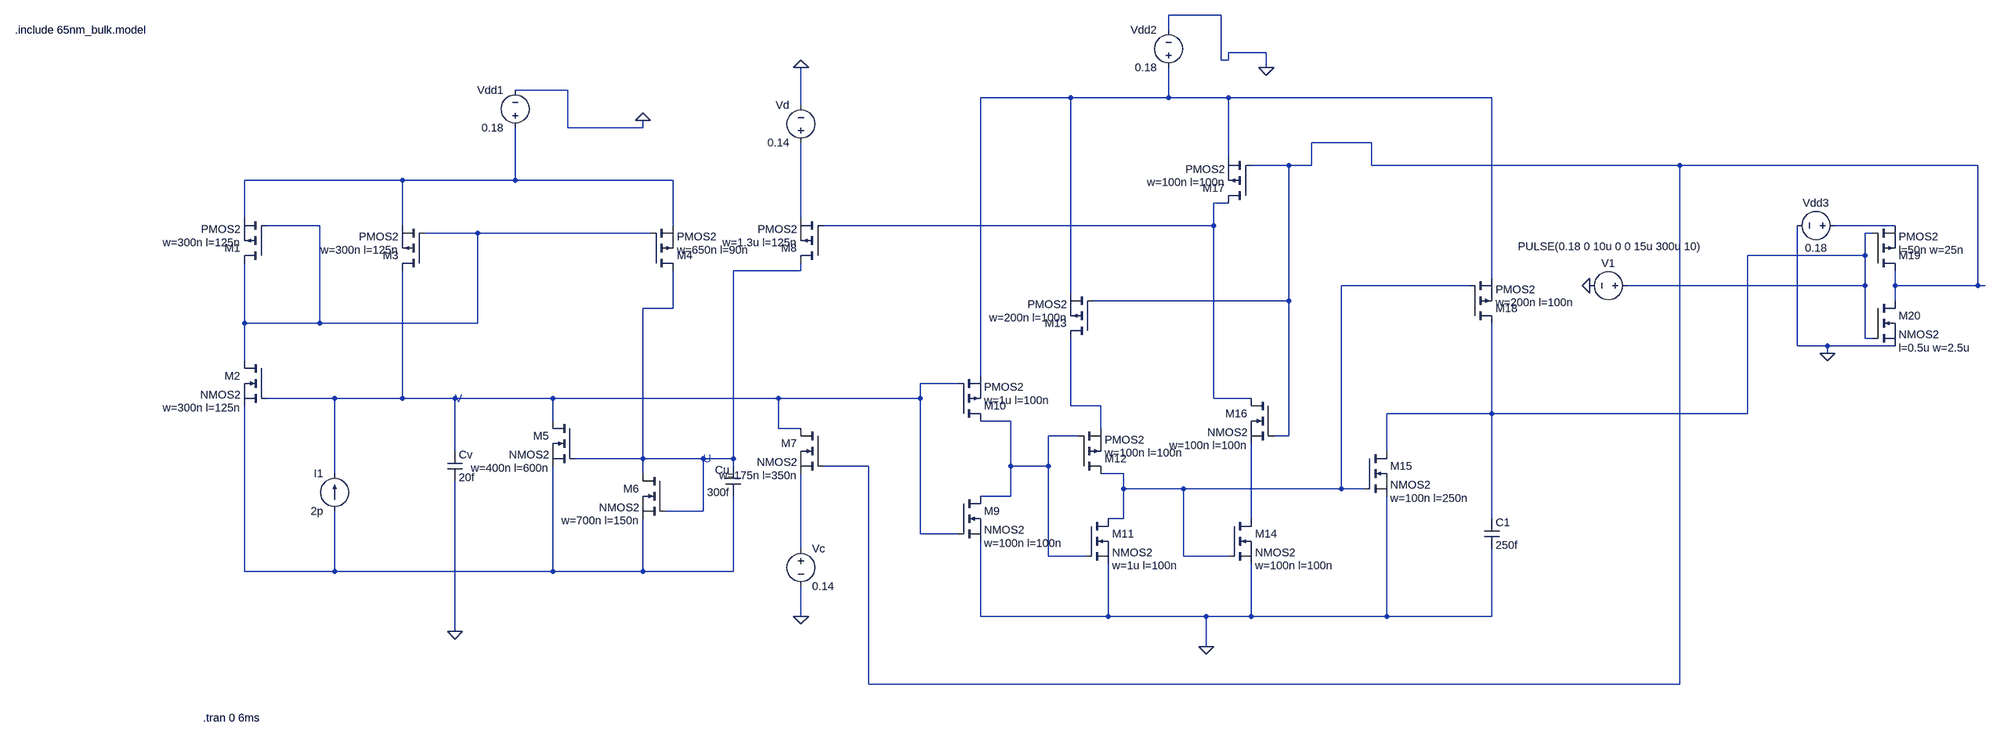
[diagram p0: schematic izhikevich_neurontemplatetest38.asc]
izhikevich_neurontemplatetest38.asc, the LTspice schematic file:
Version 4.1
SHEET 1 3168 1620
WIRE 1280 -240 1168 -240
WIRE 1168 -208 1168 -240
WIRE 1376 -160 1296 -160
WIRE 1280 -144 1280 -240
WIRE 1296 -144 1296 -160
WIRE 1296 -144 1280 -144
WIRE 1376 -128 1376 -160
WIRE -160 -80 -272 -80
WIRE 960 -64 768 -64
WIRE 1168 -64 1168 -128
WIRE 1168 -64 960 -64
WIRE 1296 -64 1168 -64
WIRE 1856 -64 1296 -64
WIRE 336 -48 336 -128
WIRE -160 0 -160 -80
WIRE 0 0 0 -16
WIRE 0 0 -160 0
WIRE 1600 32 1472 32
WIRE 1296 64 1296 -64
WIRE 1424 80 1344 80
WIRE 1472 80 1472 32
WIRE 1472 80 1424 80
WIRE 1600 80 1600 32
WIRE 2256 80 1600 80
WIRE 3088 80 2256 80
WIRE -512 112 -848 112
WIRE -272 112 -272 0
WIRE -272 112 -512 112
WIRE 64 112 -272 112
WIRE 1296 160 1264 160
WIRE -848 192 -848 112
WIRE 336 192 336 32
WIRE -688 208 -800 208
WIRE -512 208 -512 112
WIRE 64 208 64 112
WIRE 1264 208 1264 160
WIRE 1264 208 384 208
WIRE 2912 208 2784 208
WIRE -352 224 -464 224
WIRE 16 224 -352 224
WIRE 2864 224 2848 224
WIRE 2848 272 2848 224
WIRE 2848 272 2400 272
WIRE 336 304 336 288
WIRE 336 304 192 304
WIRE 1856 320 1856 -64
WIRE 1808 336 1536 336
WIRE 2848 336 2848 272
WIRE 2848 336 2144 336
WIRE 2912 336 2912 304
WIRE 3088 336 3088 80
WIRE 3088 336 2912 336
WIRE 3104 336 3088 336
WIRE 960 352 960 -64
WIRE 1424 368 1424 80
WIRE 1424 368 1008 368
WIRE 2912 368 2912 336
WIRE 64 384 64 304
WIRE 64 384 0 384
WIRE -848 416 -848 288
WIRE -688 416 -688 208
WIRE -688 416 -848 416
WIRE -352 416 -352 224
WIRE -352 416 -688 416
WIRE 2848 448 2848 336
WIRE 2864 448 2848 448
WIRE 2704 464 2704 208
WIRE 2768 464 2704 464
WIRE 2912 464 2768 464
WIRE 2768 480 2768 464
WIRE -848 496 -848 416
WIRE 768 528 768 -64
WIRE 720 544 640 544
WIRE -656 576 -800 576
WIRE -512 576 -512 304
WIRE -512 576 -656 576
WIRE -400 576 -512 576
WIRE -192 576 -400 576
WIRE 288 576 -192 576
WIRE 640 576 640 544
WIRE 640 576 288 576
WIRE 1264 576 1264 208
WIRE 1344 576 1264 576
WIRE 960 592 960 448
WIRE 1024 592 960 592
WIRE 1856 608 1856 416
WIRE 1856 608 1632 608
WIRE 2400 608 2400 272
WIRE 2400 608 1856 608
WIRE -192 624 -192 576
WIRE 832 624 768 624
WIRE 288 640 288 576
WIRE 336 640 288 640
WIRE 1024 640 1024 592
WIRE 976 656 912 656
WIRE 1424 656 1424 368
WIRE 1424 656 1392 656
WIRE -400 688 -400 576
WIRE 1632 688 1632 608
WIRE 0 704 0 384
WIRE 0 704 -144 704
WIRE 128 704 0 704
WIRE 192 704 192 304
WIRE 192 704 128 704
WIRE 192 720 192 704
WIRE 480 720 384 720
WIRE 832 720 832 624
WIRE 912 720 912 656
WIRE 912 720 832 720
WIRE -656 736 -656 576
WIRE 0 736 0 704
WIRE 1072 736 1024 736
WIRE 1072 768 1072 736
WIRE 1200 768 1072 768
WIRE 1536 768 1536 336
WIRE 1536 768 1200 768
WIRE 1584 768 1536 768
WIRE 832 784 832 720
WIRE 832 784 768 784
WIRE 128 816 128 704
WIRE 128 816 48 816
WIRE 1072 832 1072 768
WIRE 1072 832 1040 832
WIRE 1344 832 1344 672
WIRE 1856 832 1856 608
WIRE 640 864 640 576
WIRE 720 864 640 864
WIRE 336 896 336 736
WIRE 912 912 912 720
WIRE 992 912 912 912
WIRE 1200 912 1200 768
WIRE 1296 912 1200 912
WIRE -848 944 -848 592
WIRE -656 944 -656 816
WIRE -656 944 -848 944
WIRE -192 944 -192 720
WIRE -192 944 -656 944
WIRE 0 944 0 832
WIRE 0 944 -192 944
WIRE 192 944 192 784
WIRE 192 944 0 944
WIRE 336 1040 336 976
WIRE 768 1040 768 880
WIRE 1040 1040 1040 928
WIRE 1040 1040 768 1040
WIRE 1248 1040 1040 1040
WIRE 1344 1040 1344 928
WIRE 1344 1040 1248 1040
WIRE 1632 1040 1632 784
WIRE 1632 1040 1344 1040
WIRE 1856 1040 1856 896
WIRE 1856 1040 1632 1040
WIRE -400 1072 -400 752
WIRE 1248 1104 1248 1040
WIRE 480 1184 480 720
WIRE 2256 1184 2256 80
WIRE 2256 1184 480 1184
FLAG 0 -16 0
FLAG 336 -128 0
FLAG 1376 -128 0
FLAG 336 1040 0
FLAG -400 1072 0
FLAG 1248 1104 0
FLAG 2768 480 0
FLAG 2064 336 0
DATAFLAG 3072 336 ""
DATAFLAG 2832 336 ""
DATAFLAG 2304 336 ""
DATAFLAG 2064 80 ""
SYMBOL voltage 336 880 R0
WINDOW 123 0 0 Left 0
WINDOW 39 0 0 Left 0
SYMATTR InstName Vc
SYMATTR Value 0.14
SYMBOL current -656 816 R180
WINDOW 0 24 80 Left 2
WINDOW 3 24 0 Left 2
WINDOW 123 0 0 Left 0
WINDOW 39 0 0 Left 0
SYMATTR InstName I1
SYMATTR Value 2p
SYMBOL voltage -272 16 R180
WINDOW 0 24 96 Left 2
WINDOW 3 24 16 Left 2
WINDOW 123 0 0 Left 0
WINDOW 39 0 0 Left 0
SYMATTR InstName Vdd1
SYMATTR Value 0.18
SYMBOL voltage 1168 -112 R180
WINDOW 0 24 96 Left 2
WINDOW 3 24 16 Left 2
WINDOW 123 0 0 Left 0
WINDOW 39 0 0 Left 0
SYMATTR InstName Vdd2
SYMATTR Value 0.18
SYMBOL voltage 336 48 R180
WINDOW 0 24 96 Left 2
WINDOW 3 24 16 Left 2
WINDOW 123 0 0 Left 0
WINDOW 39 0 0 Left 0
SYMATTR InstName Vd
SYMATTR Value 0.14
SYMBOL cap 208 720 M0
SYMATTR InstName Cu
SYMATTR Value 300f
SYMBOL cap -416 688 R0
SYMATTR InstName Cv
SYMATTR Value 20f
SYMBOL cap 1840 832 R0
SYMATTR InstName C1
SYMATTR Value 250f
SYMBOL pmos -800 288 R180
WINDOW 123 56 44 Left 2
WINDOW 39 56 16 Left 2
SYMATTR Value2 w=300n l=125n
SYMATTR InstName M1
SYMATTR Value PMOS2
SYMBOL pmos -464 304 R180
WINDOW 123 56 44 Left 2
SYMATTR Value2 w=300n l=125n
SYMATTR InstName M3
SYMATTR Value PMOS2
SYMBOL pmos 16 304 M180
WINDOW 123 56 44 Left 2
WINDOW 39 56 16 Left 2
SYMATTR Value2 w=650n l=90n
SYMATTR InstName M4
SYMATTR Value PMOS2
SYMBOL pmos 384 288 R180
WINDOW 123 56 44 Left 2
SYMATTR Value2 w=1.3u l=125n
SYMATTR InstName M8
SYMATTR Value PMOS2
SYMBOL pmos 720 624 M180
WINDOW 123 56 44 Left 2
SYMATTR Value2 w=1u l=100n
SYMATTR InstName M10
SYMATTR Value PMOS2
SYMBOL pmos 1008 448 R180
WINDOW 123 56 44 Left 2
SYMATTR Value2 w=200n l=100n
SYMATTR InstName M13
SYMATTR Value PMOS2
SYMBOL pmos 1344 160 R180
WINDOW 123 56 44 Left 2
SYMATTR Value2 w=100n l=100n
SYMATTR InstName M17
SYMATTR Value PMOS2
SYMBOL pmos 1808 416 M180
WINDOW 123 56 44 Left 2
SYMATTR Value2 w=200n l=100n
SYMATTR InstName M18
SYMATTR Value PMOS2
SYMBOL nmos -800 496 M0
WINDOW 123 56 100 Left 2
WINDOW 39 56 128 Left 2
SYMATTR Value2 w=300n l=125n
SYMATTR InstName M2
SYMATTR Value NMOS2
SYMBOL nmos -144 624 M0
WINDOW 123 56 100 Left 2
WINDOW 39 56 128 Left 2
SYMATTR Value2 w=400n l=600n
SYMATTR InstName M5
SYMATTR Value NMOS2
SYMBOL nmos 48 736 M0
WINDOW 123 56 100 Left 2
WINDOW 39 56 128 Left 2
SYMATTR Value2 w=700n l=150n
SYMATTR InstName M6
SYMATTR Value NMOS2
SYMBOL nmos 384 640 M0
WINDOW 123 56 100 Left 2
SYMATTR Value2 w=175n l=350n
SYMATTR InstName M7
SYMATTR Value NMOS2
SYMBOL nmos 720 784 R0
WINDOW 123 56 100 Left 2
SYMATTR Value2 w=100n l=100n
SYMATTR InstName M9
SYMATTR Value NMOS2
SYMBOL nmos 992 832 R0
WINDOW 123 56 100 Left 2
SYMATTR Value2 w=1u l=100n
SYMATTR InstName M11
SYMATTR Value NMOS2
SYMBOL nmos 1296 832 R0
WINDOW 123 56 100 Left 2
SYMATTR Value2 w=100n l=100n
SYMATTR InstName M14
SYMATTR Value NMOS2
SYMBOL nmos 1584 688 R0
WINDOW 123 56 100 Left 2
SYMATTR Value2 w=100n l=250n
SYMATTR InstName M15
SYMATTR Value NMOS2
SYMBOL nmos 1392 576 M0
WINDOW 123 56 100 Left 2
SYMATTR Value2 w=100n l=100n
SYMATTR InstName M16
SYMATTR Value NMOS2
SYMBOL pmos 976 736 M180
WINDOW 123 56 44 Left 2
SYMATTR Value2 w=100n l=100n
SYMATTR InstName M12
SYMATTR Value PMOS2
SYMBOL pmos 2864 304 M180
WINDOW 123 56 44 Left 2
SYMATTR Value2 l=50n w=25n
SYMATTR InstName M19
SYMATTR Value PMOS2
SYMBOL nmos 2864 368 R0
WINDOW 123 56 100 Left 2
SYMATTR Value2 l=0.5u w=2.5u
SYMATTR InstName M20
SYMATTR Value NMOS2
SYMBOL voltage 2800 208 R90
WINDOW 0 -32 56 VBottom 2
WINDOW 3 32 56 VTop 2
WINDOW 123 0 0 Left 0
WINDOW 39 0 0 Left 0
SYMATTR InstName Vdd3
SYMATTR Value 0.18
SYMBOL voltage 2160 336 R90
WINDOW 0 -32 56 VBottom 2
WINDOW 3 -99 53 VTop 2
WINDOW 123 0 0 Left 0
WINDOW 39 0 0 Left 0
SYMATTR InstName V1
SYMATTR Value PULSE(0.18 0 10u 0 0 15u 300u 10)
TEXT 128 704 Left 2 ;U
TEXT -400 576 Left 2 ;V
TEXT -936 1256 Left 2 !.tran 0 6ms
TEXT -1336 -208 Left 2 !.include 65nm_bulk.model

The netlist it stands for:
* izhikevich_neurontemplatetest38.asc
Vc N015 0 0.14
I1 N016 N011 2p
Vdd1 N003 0 0.18
Vdd2 N001 0 0.18
Vd N005 0 0.14
Cu N009 N016 300f
Cv N011 0 20f
C1 N008 0 250f
M1 N006 N006 N003 N003 PMOS2 w=300n l=125n
M3 N011 N006 N003 N003 PMOS2 w=300n l=125n
M4 N009 N006 N003 N003 PMOS2 w=650n l=90n
M8 N009 N004 N005 N005 PMOS2 w=1.3u l=125n
M10 N013 N011 N001 N001 PMOS2 w=1u l=100n
M13 N012 N002 N001 N001 PMOS2 w=200n l=100n
M17 N004 N002 N001 N001 PMOS2 w=100n l=100n
M18 N008 N010 N001 N001 PMOS2 w=200n l=100n
M2 N006 N011 N016 N016 NMOS2 w=300n l=125n
M5 N011 N009 N016 N016 NMOS2 w=400n l=600n
M6 N009 N009 N016 N016 NMOS2 w=700n l=150n
M7 N011 N002 N015 N015 NMOS2 w=175n l=350n
M9 N013 N011 0 0 NMOS2 w=100n l=100n
M11 N010 N013 0 0 NMOS2 w=1u l=100n
M14 N014 N010 0 0 NMOS2 w=100n l=100n
M15 N008 N010 0 0 NMOS2 w=100n l=250n
M16 N004 N002 N014 N014 NMOS2 w=100n l=100n
M12 N010 N013 N012 N012 PMOS2 w=100n l=100n
M19 N002 N008 N007 N007 PMOS2 l=50n w=25n
M20 N002 N008 0 0 NMOS2 l=0.5u w=2.5u
Vdd3 N007 0 0.18
V1 N008 0 PULSE(0.18 0 10u 0 0 15u 300u 10)
.model NMOS NMOS
.model PMOS PMOS
.lib standard.mos
* U
* V
.tran 0 6ms
.include 65nm_bulk.model
.backanno
.end